# EAGLE design FT231X-Breakout (EAGLE 7.6.0)
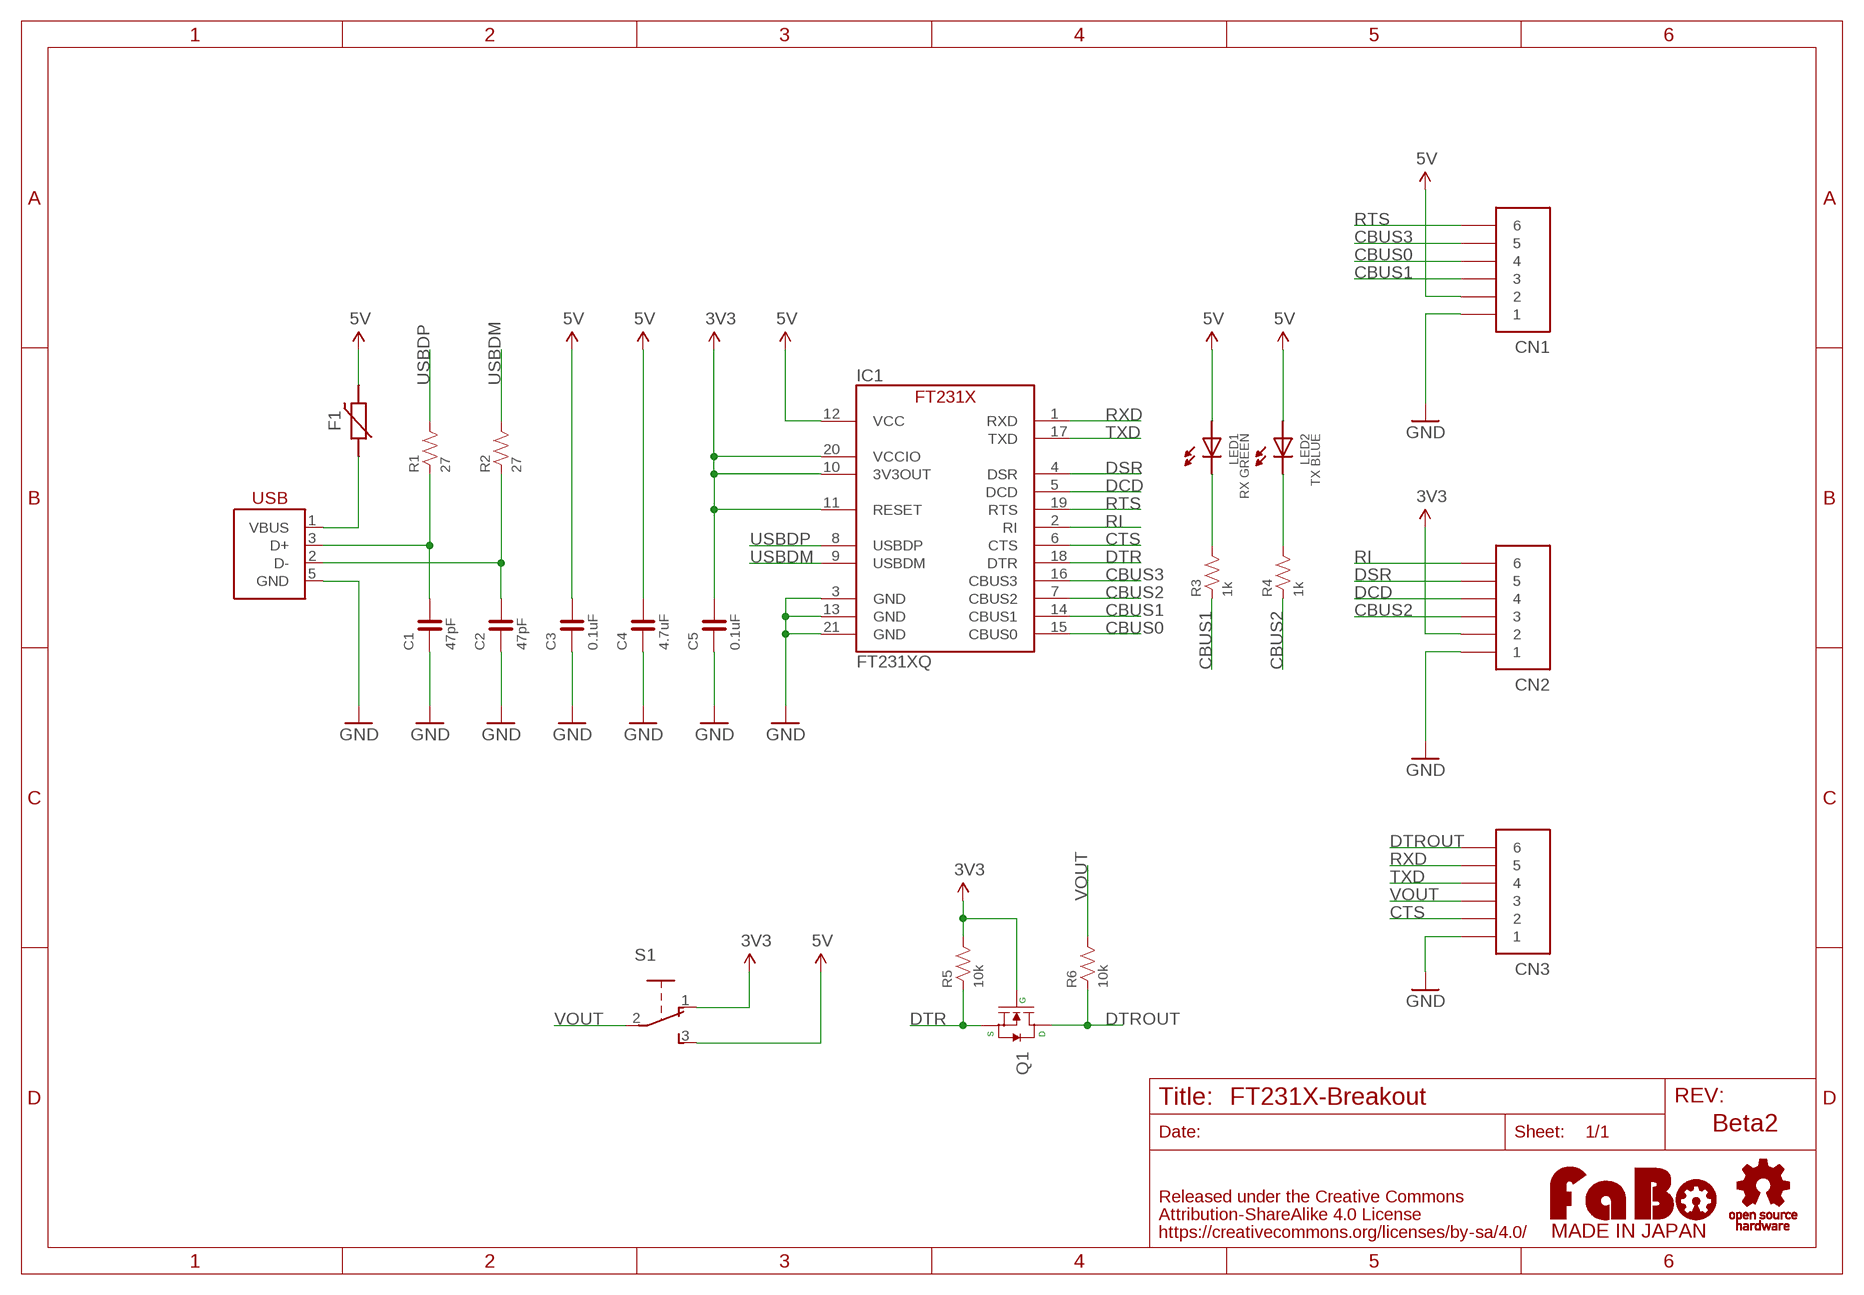
[diagram p0: schematic, sheet 1]

## Parts
C1  47pF  CAPACITOR-0603_NARROW  [0603-NARROW]
C2  47pF  CAPACITOR-0603_NARROW  [0603-NARROW]
C3  0.1uF  CAPACITOR-0603_NARROW  [0603-NARROW]
C4  4.7uF  CAPACITOR-0603_NARROW  [0603-NARROW]
C5  0.1uF  CAPACITOR-0603_NARROW  [0603-NARROW]
CN1  PIN_HEADER_1X6  [PIN_1X6]
CN2  PIN_HEADER_1X6  [PIN_1X6]
CN3  PIN_HEADER_1X6  [PIN_1X6]
F1  POLYSWITCH  [EIA0603]
IC1  FT231XQ  [QFN-20_FT231X]
LED1  RX GREEN  LED-0603-NARROW  [0603-NARROW]
LED2  TX BLUE  LED-0603-NARROW  [0603-NARROW]
Q1  MOSFET-N  [SOT23-3]
R1  27  RESISTOR-0603-NARROW  [0603-NARROW]
R2  27  RESISTOR-0603-NARROW  [0603-NARROW]
R3  1k  RESISTOR-0603-NARROW  [0603-NARROW]
R4  1k  RESISTOR-0603-NARROW  [0603-NARROW]
R5  10k  RESISTOR-0603-NARROW  [0603-NARROW]
R6  10k  RESISTOR-0603-NARROW  [0603-NARROW]
S1  SLIDE-SSSS810701  [SSSS810701]
U$2  LOGO_FABO-M_BOTTOM  [LOGO_FABO_MS_BOTTOM]
U$3  LOGO_OSHW-M_BOTTOM  [LOGO_OSHW_M_BOTTOM]
USB1  USB-MICRO_B_SMT_HIROSE  [ZX62R-B-5P]

## Nets
3V3: C5.2 CN2.2 IC1.10(3V3OUT) IC1.11(RESET) IC1.20(VCCIO) Q1.1(G) R5.2 S1.1
5V: C3.2 C4.2 CN1.2 F1.2 IC1.12(VCC) LED1.ANODE LED2.ANODE S1.3
CBUS0: CN1.4 IC1.15(CBUS0)
CBUS1: CN1.3 IC1.14(CBUS1) R3.1
CBUS2: CN2.3 IC1.7(CBUS2) R4.1
CBUS3: CN1.5 IC1.16(CBUS3)
CTS: CN3.2 IC1.6(CTS)
DCD: CN2.4 IC1.5(DCD)
DSR: CN2.5 IC1.4(DSR)
DTR: IC1.18(DTR) Q1.2(S) R5.1
DTROUT: CN3.6 Q1.3(D) R6.1
GND: C1.1 C2.1 C3.1 C4.1 C5.1 CN1.1 CN2.1 CN3.1 IC1.3(GND) IC1.13(GND) IC1.21(GND) USB1.5(GND)
N$3: C2.2 R2.1 USB1.2(D-)
N$4: C1.2 R1.1 USB1.3(D+)
N$33: LED1.CATHODE R3.2
N$35: LED2.CATHODE R4.2
RI: CN2.6 IC1.2(RI)
RTS: CN1.6 IC1.19(RTS)
RXD: CN3.5 IC1.1(RXD)
TXD: CN3.4 IC1.17(TXD)
USBDM: IC1.9(USBDM) R2.2
USBDP: IC1.8(USBDP) R1.2
VBUS: F1.1 USB1.1(VBUS)
VOUT: CN3.3 R6.2 S1.2

## Notes on the sheet
- Beta2

## Library data of the parts
C1-C5 = FaBo-Capacitor:CAPACITOR: CAPACITOR
CN1-CN3 = FaBo-PIN:PIN_HEADER_1X6
F1 = FaBo-etc:POLYSWITCH
IC1 = FaBo-USB:FT231X
LED1 LED2 = FaBo-LED:LED
Q1 = FaBo-etc:MOSFET-N
R1-R6 = FaBo-Resistors:RESISTOR: RESISTOR
S1 = FaBo-Switch:SLIDE
U$2 = FaBo-Logo:LOGO_FABO
U$3 = FaBo-Logo:LOGO_OSHW
USB1 = FaBo-USB:USB

## Board
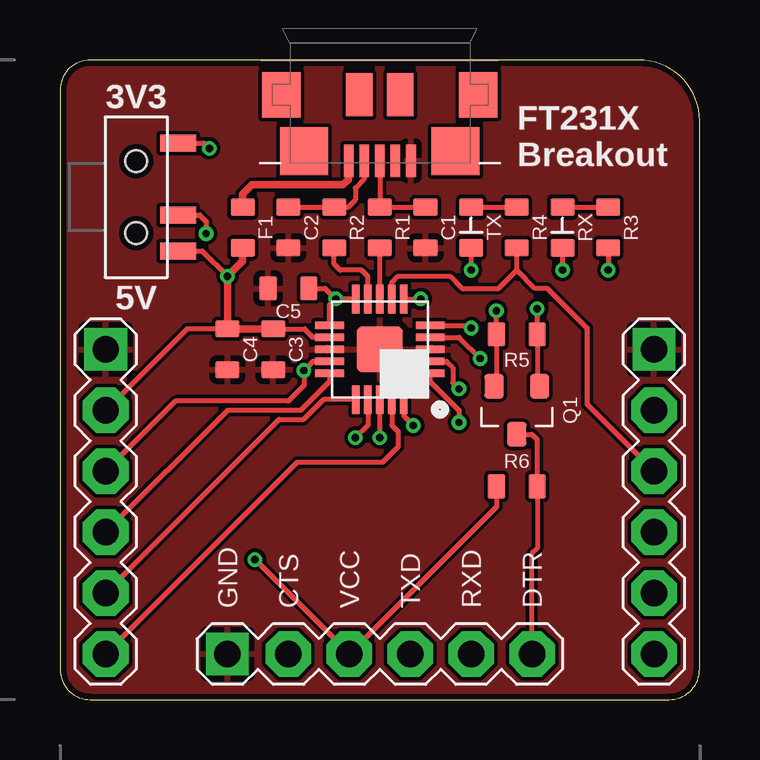
[diagram p1: board, top side]
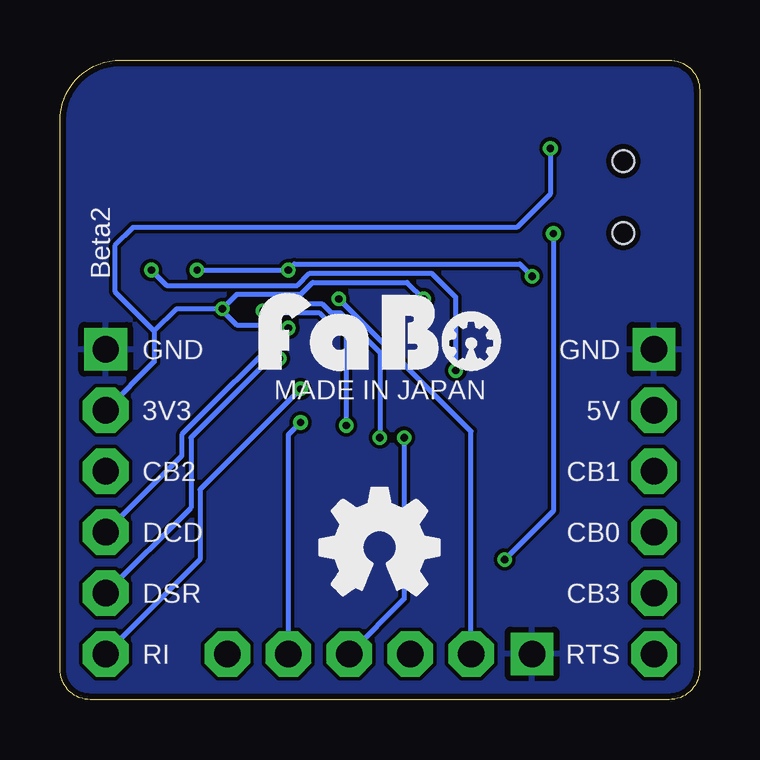
[diagram p2: board, bottom side, seen from below]

Size 26.67 x 26.67 mm. Coordinates in mm from the lower left corner, seen from the top.
Outline: 26.67,1.27 26.67,24.13 arc90 24.13,26.67 1.27,26.67 arc90 0,25.4 0,1.27 arc90 1.27,0 25.4,0 arc90 26.67,1.27
Copper layers (1*16): Top 0.035mm / dielectric 1.5mm / Bottom 0.035mm
Design rules "Elecrow_angle": minimum track width 6mil, minimum drill 12mil, track to track 6mil, track to pad 6mil, pad to pad 6mil, via to via 6mil, smd to smd 0mil, copper to edge 10mil, drill to drill 10mil, minimum pad ring 10mil, minimum via ring 6mil, stop-mask expansion 2mil, vias tented up to drill 100mil, thermal gap 10mil

### Footprints (pad centres in the part's own frame; a part is rotated, then mirrored left to right if it is on the bottom)
0603-NARROW = smd 0.71 x 1: 1 -0.85,0; 2 0.85,0
PIN_1X6 = drill 1.1 pad 1.778 square: 1 -6.35,0 | drill 1.1 pad 1.9 octagon: 2 -3.81,0; 3 -1.27,0; 4 1.27,0; 5 3.81,0; 6 6.35,0
EIA0603 = smd 0.75 x 1: 1 -0.85,0; 2 0.85,0
QFN-20_FT231X = smd 1.2 x 0.3: 1 -2.1,1; 2 -2.1,0.5; 3 -2.1,0; 4 -2.1,-0.5; 5 -2.1,-1; 11 2.1,-1; 12 2.1,-0.5; 13 2.1,0; 14 2.1,0.5; 15 2.1,1 | smd 0.3 x 1.2: 6 -1,-2.1; 7 -0.5,-2.1; 8 0,-2.1; 9 0.5,-2.1; 10 1,-2.1; 16 1,2.1; 17 0.5,2.1; 18 0,2.1; 19 -0.5,2.1; 20 -1,2.1 | smd 1.9 x 1.9: 21 0,0
0603-NARROW' = smd 0.75 x 1: ANODE -0.85,0; CATHODE 0.85,0
SOT23-3 = smd 0.8 x 1: 1 -0.95,-1; 2 0.95,-1; 3 0,1
SSSS810701 = smd 0.7 x 1.5: 1 -2.25,1.75; 2 0.75,1.75; 3 2.25,1.75 | hole 0.9: -1.5,0; 1.5,0
ZX62R-B-5P = smd 0.4 x 1.35: 1 1.3,4.2; 2 0.65,4.2; 3 0,4.2; 4 -0.65,4.2; 5 -1.3,4.2 | smd 2 x 2: 6 3.15,3.8; 7 -3.15,3.8 | smd 1.6 x 1.9: 8 4.1,1.45; 11 -4.1,1.45 | smd 1.1 x 1.8: 9 0.85,1.45; 10 -0.85,1.45

### Placement (x,y rotation side)
C1  15.24,19.68 90 top
C2  9.53,19.68 90 top
C3  8.89,14.61 90 top
C4  6.99,14.61 90 top
C5  9.53,17.14 0 top
CN1  1.91,8.26 270 top
CN2  24.77,8.26 270 top
CN3  13.34,1.91 0 top
F1  7.62,19.68 270 top
IC1  13.34,14.61 180 top
LED1  RX GREEN  [0603-NARROW']  20.95,19.68 90 top
LED2  TX BLUE  [0603-NARROW']  17.14,19.68 90 top
Q1  19.05,12.06 180 top
R1  13.34,19.68 270 top
R2  11.43,19.68 270 top
R3  22.86,19.68 90 top
R4  19.05,19.68 90 top
R5  19.05,15.24 0 top
R6  19.05,8.89 180 top
S1  3.17,20.95 270 top
U$2  13.34,13.34 0 top
U$3  13.34,6.35 0 top
USB1  13.34,26.67 180 top

### Tracks (layer width: path | path; a pad name or v marks a point on that pad's centre or on a via)
3V3  (via drill 0.3)
  Top 0.203: IC1.10 v11.5,16.7 | IC1.11 11.23,16.44 v11.5,16.7 | C5.2 11.06,17.14 v11.5,16.7 | v19.9,16.3 R5.2 19.9,13.16 Q1.1 | IC1.20 14.34,11.83 v14.73,11.43 | S1.1 6,23.2 v6.22,22.99
  Bottom 0.203: v11.5,16.7 12.19,17.4 16.13,17.4 16.64,16.89 19.3,16.89 v19.9,16.3 | v19.9,16.3 19.9,16.22 19.3,15.62 17.91,15.62 17.4,16.13 15.88,16.13 15.49,15.75 15.11,15.75 14.73,15.37 v14.73,11.43 | v6.22,22.99 6.22,21.08 7.62,19.68 23.62,19.68 24.38,18.92 24.38,17.02 22.73,15.37 | CN2.2 22.73,14.1 22.73,15.37 | v19.9,16.3 21.8,16.3 22.73,15.37
5V  (via drill 0.3)
  Top 0.203: IC1.12 10.55,15.11 10.2,15.46 C3.2 | LED2.ANODE v17.14,17.91 | LED1.ANODE v20.95,17.91 | C4.2 5.29,15.46 CN1.2 | S1.3 5.93,18.7 v6.99,17.65
  Top 0.305: F1.2 7.62,18.29 v6.99,17.65 C4.2 C3.2
  Bottom 0.203: v20.95,17.91 v17.14,17.91 16.89,18.16 7.49,18.16 v6.99,17.65
CBUS0
  Top 0.203: IC1.15 11.23,13.27 10.03,12.06 6.99,12.06 CN1.4
CBUS1  (via drill 0.3)
  Top 0.203: R3.1 v22.86,17.91 | IC1.14 10.55,14.11 v10.17,13.72 10.17,13.09 9.53,12.45 4.83,12.45 CN1.3
  Bottom 0.203: v22.86,17.91 22.23,17.27 16.76,17.27 16.26,17.78 11.18,17.78 10.17,16.77 v10.17,13.72
CBUS2
  Top 0.203: IC1.7 13.84,17.39 14.1,17.65 16.26,17.65 16.76,17.14 18.29,17.14 19.05,17.91 | 19.05,17.91 R4.1 | CN2.3 21.97,12.32 21.97,15.49 20.32,17.14 19.81,17.14 19.05,17.91
CBUS3
  Top 0.203: CN1.5 9.14,11.68 10.16,11.68 10.98,12.51 IC1.16
CTS  (via drill 0.3)
  Top 0.203: IC1.6 v15.04,16.7
  Bottom 0.203: CN3.2 9.53,11.19 v15.04,16.7
DCD  (via drill 0.3)
  Top 0.203: IC1.5 17.03,15.61 v17.14,15.49
  Bottom 0.203: CN2.4 21.59,10.16 21.59,11.05 v17.14,15.49
DSR  (via drill 0.3)
  Top 0.203: IC1.4 16.64,15.11 v17.53,14.22
  Bottom 0.203: v17.53,14.22 17.91,14.22 21.21,10.92 21.21,8 CN2.5
DTR  (via drill 0.3)
  Top 0.203: v18.2,16.22 R5.1 18.2,13.16 Q1.2 | v13.34,10.92 IC1.18
  Bottom 0.203: v18.2,16.22 17.91,16.51 15.75,16.51 15.37,16.13 14.99,16.13 13.34,14.48 v13.34,10.92
DTROUT
  Top 0.203: Q1.3 19.67,11.06 19.9,10.83 R6.1 19.9,6.31 19.68,6.1 CN3.6
GND
  pour Bottom: 0,0 26.67,0 26.67,26.67 0,26.67
  pour Top: 0,0 26.67,0 26.67,26.67 0,26.67
N$3
  Top 0.203: USB1.2 12.69,21.7 12.32,21.34 12.32,20.83 12.03,20.54 R2.1 C2.2
N$4
  Top 0.203: USB1.3 R1.1 C1.2
N$33
  Top 0.203: LED1.CATHODE R3.2
N$35
  Top 0.203: LED2.CATHODE R4.2
RI  (via drill 0.3)
  Top 0.203: IC1.2 16.12,14.11 16.38,13.84 16.38,13.21 v16.64,12.95
  Bottom 0.203: v16.64,12.95 20.83,8.76 20.83,5.84 CN2.6
RTS
  Top 0.203: IC1.19 13.84,11.44 14.1,11.18 14.1,10.54 13.46,9.91 9.91,9.91 CN1.6
RXD  (via drill 0.3)
  Top 0.203: IC1.1 15.44,13.27 16.64,12.06 v16.64,11.56
  Bottom 0.203: CN3.5 17.14,11.05 v16.64,11.56
TXD  (via drill 0.3)
  Top 0.203: IC1.17 12.84,11.44 v12.32,10.92
  Bottom 0.203: v12.32,10.92 12.32,4.19 CN3.4
USBDM
  Top 0.203: IC1.9 12.84,17.64 12.57,17.91 11.68,17.91 11.43,18.16 R2.2
USBDP
  Top 0.203: IC1.8 R1.2
VBUS
  Top 0.305: USB1.1 12.04,21.69 11.81,21.46 8,21.46 7.62,21.08 F1.1
VOUT  (via drill 0.3)
  Top 0.203: R6.2 18.2,8.04 CN3.3 v8.13,5.84 | S1.2 5.83,20.2 6.1,19.94 v6.1,19.43
  Bottom 0.203: v6.1,19.43 6.1,7.87 v8.13,5.84

### Text on the board
tPlace: 3V3 | FT231X / Breakout | TX | RX | 5V | GND | CTS | VCC | TXD | RXD | DTR
bPlace: Beta2 | GND | GND | MADE IN JAPAN | 5V | 3V3 | CB1 | CB2 | CB0 | DCD | CB3 | DSR | RTS | RI